# EAGLE schematic HotFireBoard (EAGLE 9.0.1)
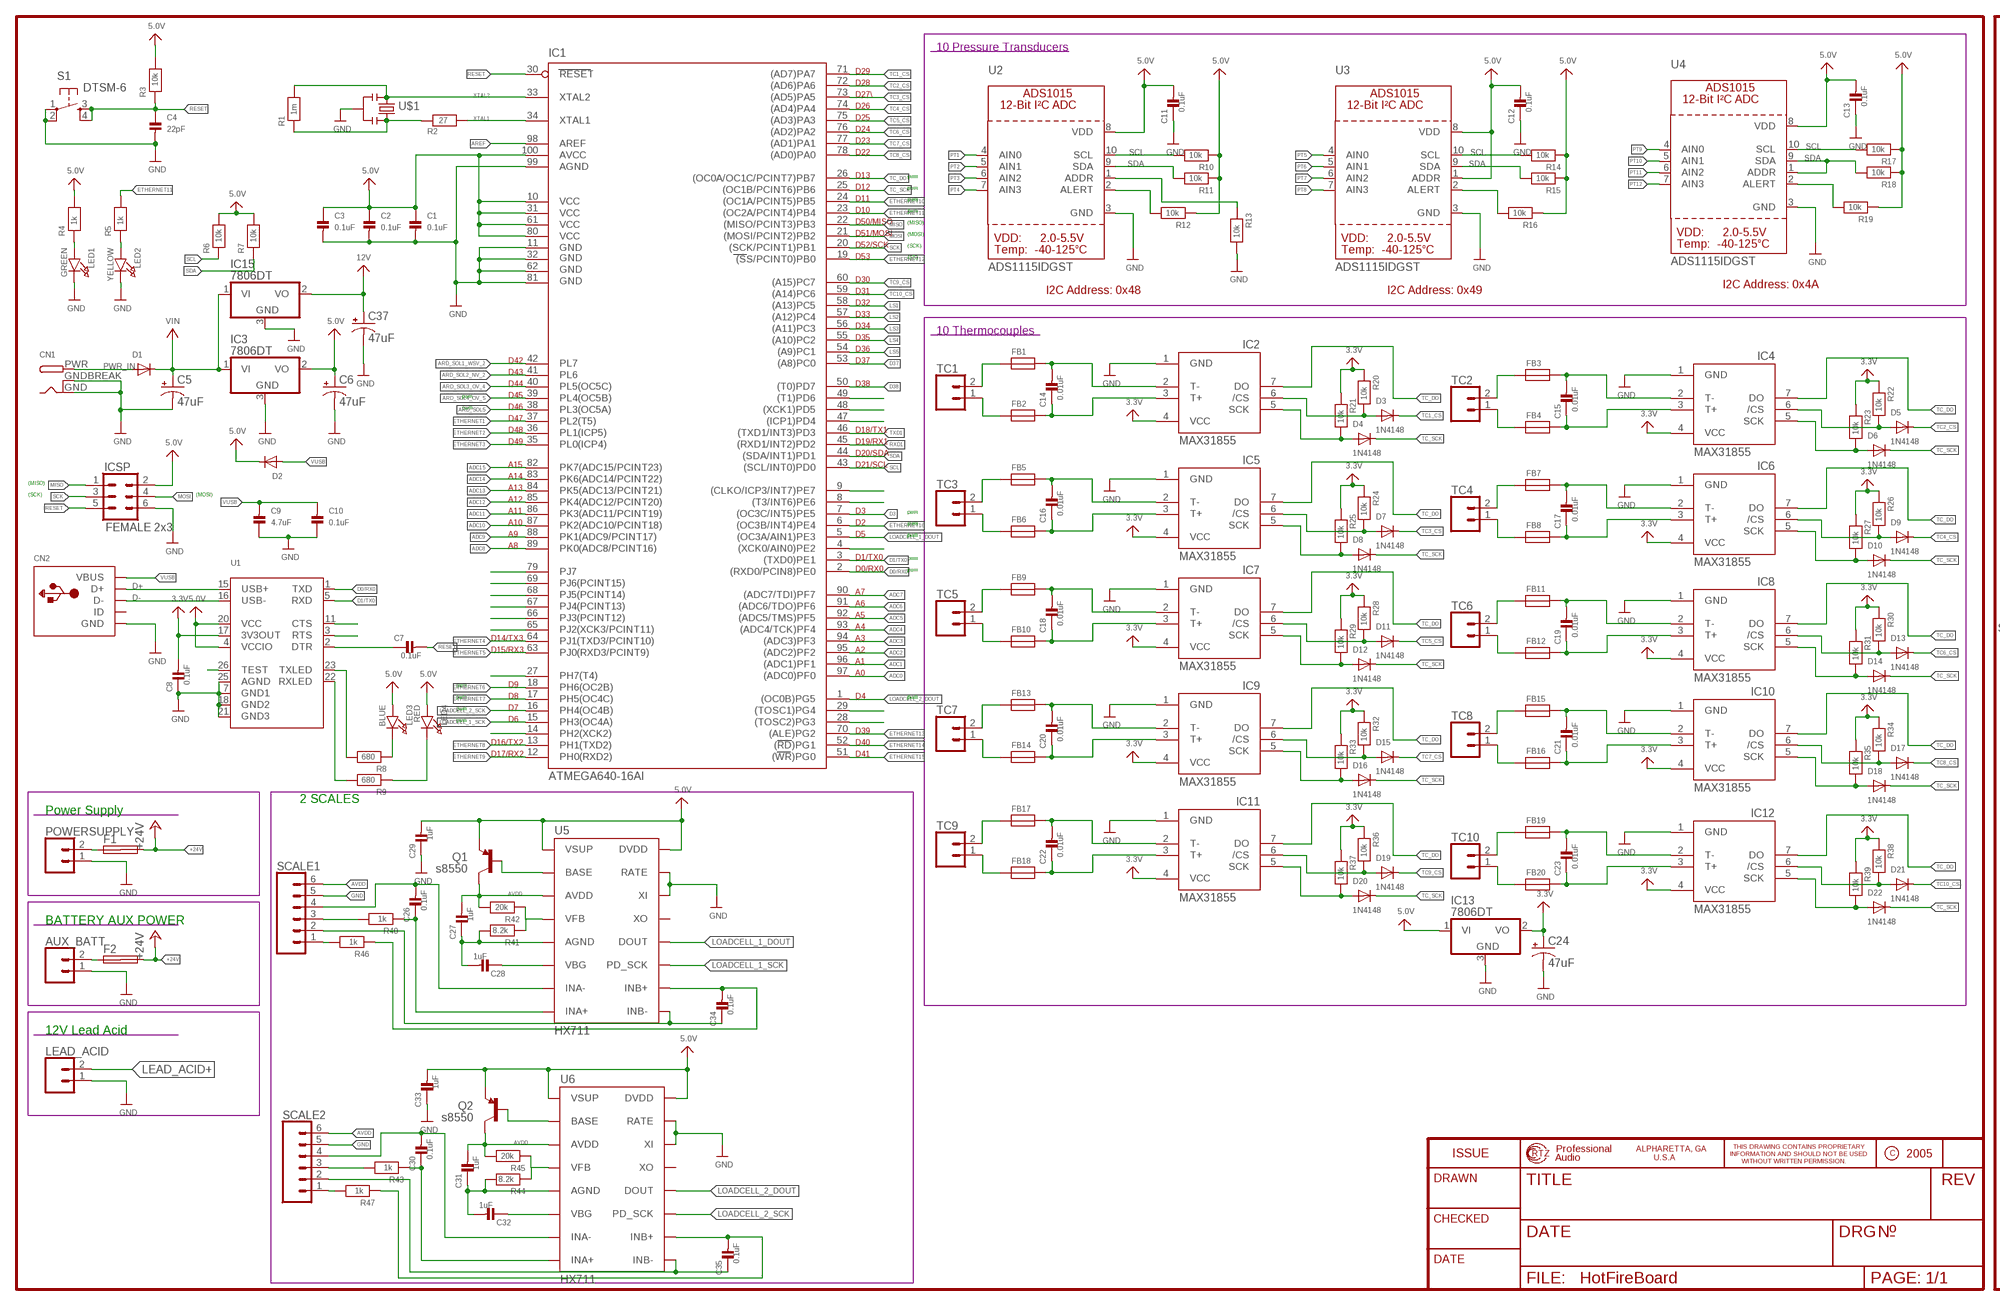
[diagram p0: schematic, sheet 1, part 1 of 2]
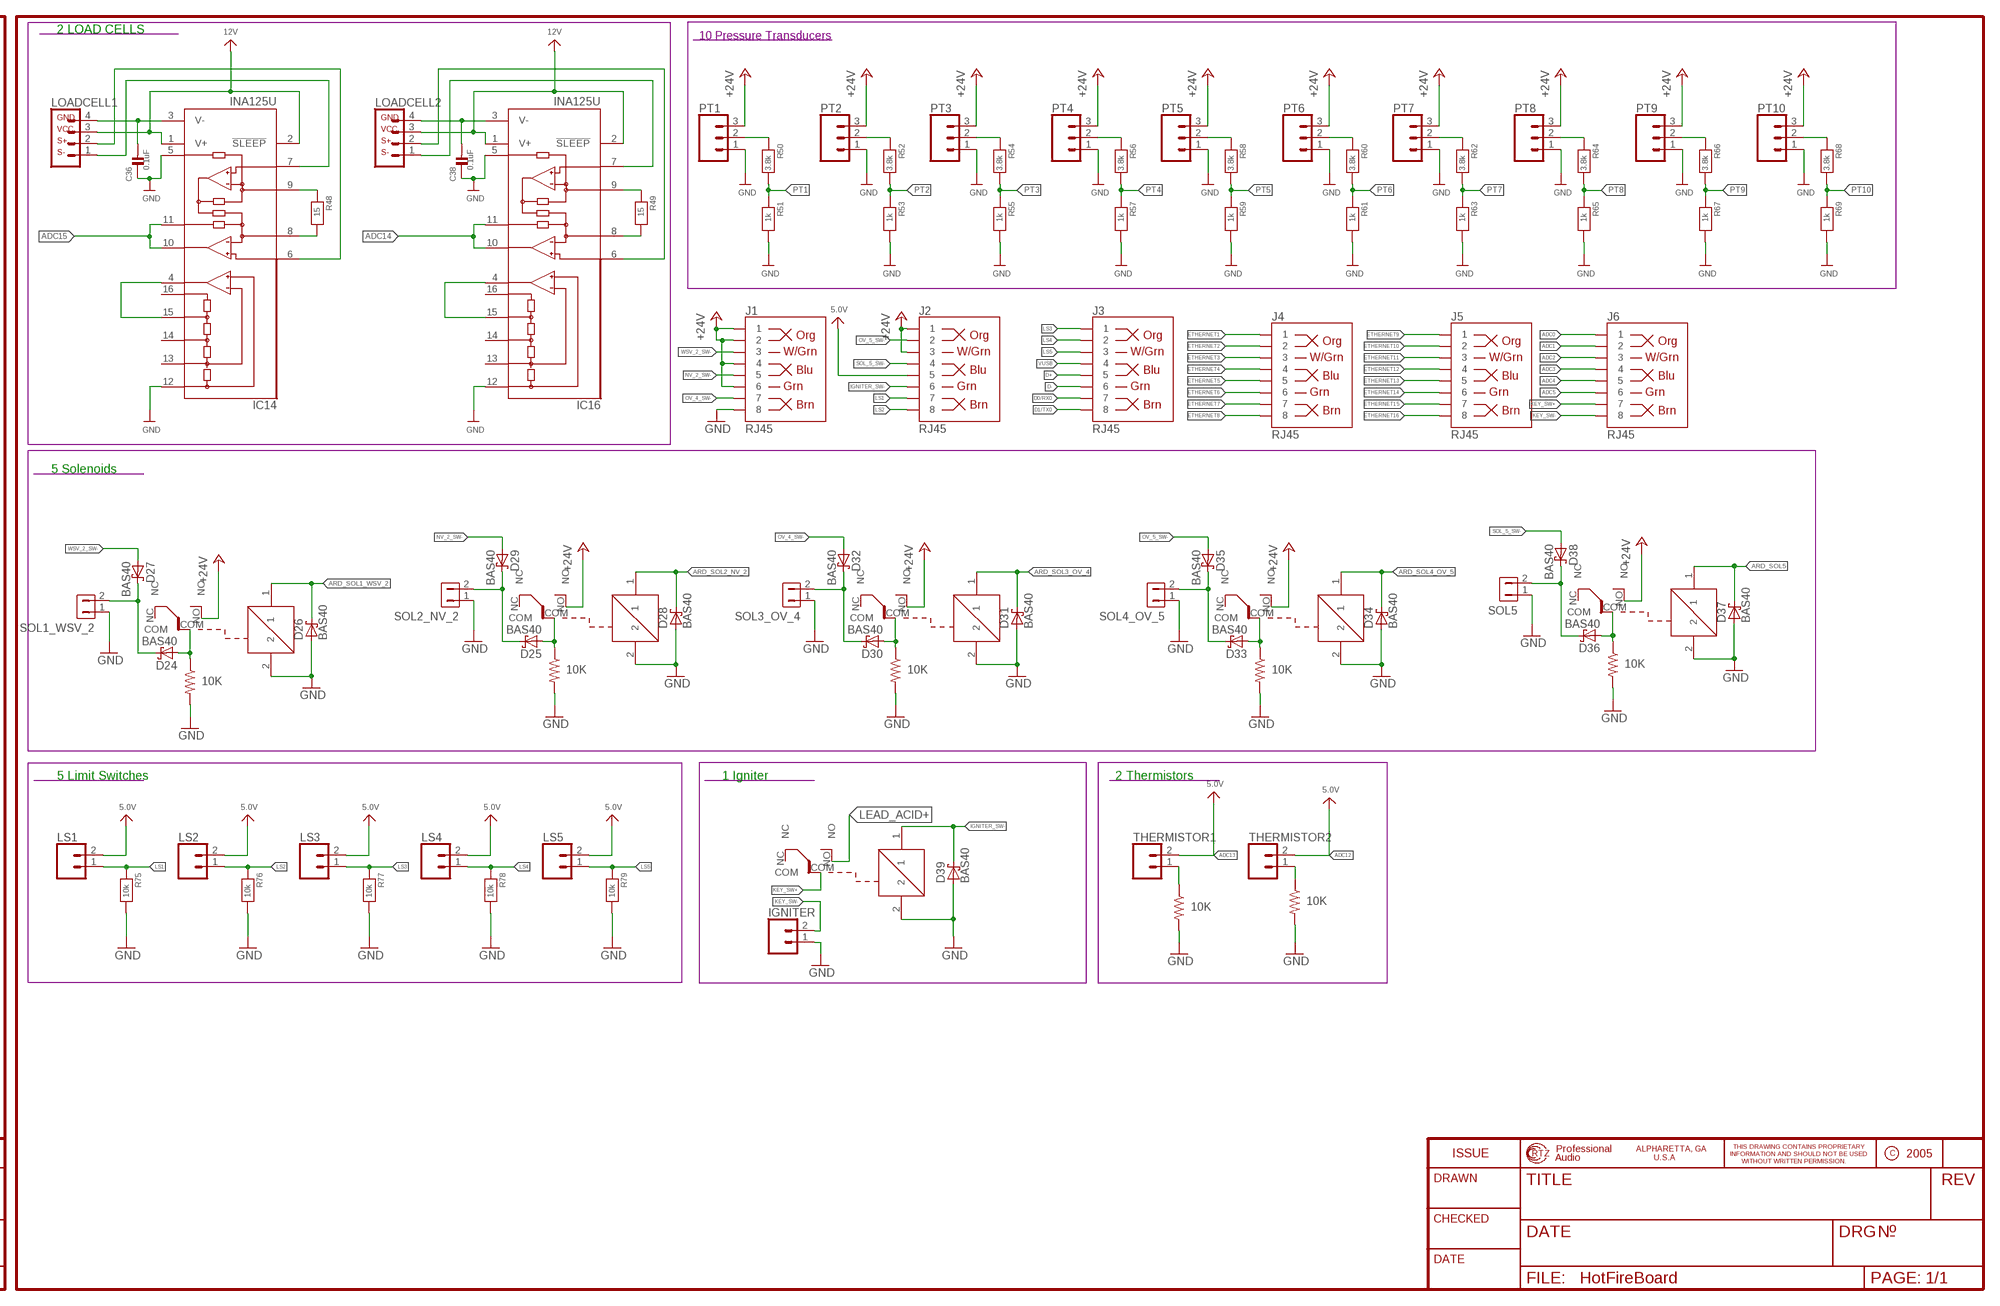
[diagram p1: schematic, sheet 1, part 2 of 2]

## Parts
AUX_BATT  CONN_02  [1X02]
C1  0.1uF  CAP_CERAMIC0805  [0805]
C2  0.1uF  CAP_CERAMIC0805  [0805]
C3  0.1uF  CAP_CERAMIC0805  [0805]
C4  22pF  CAP_CERAMIC0805  [0805]
C5  47uF  CPOL-USD  [PANASONIC_D]
C6  47uF  CPOL-USD  [PANASONIC_D]
C7  0.1uF  CAP_CERAMIC0805  [0805]
C8  0.1uF  CAP_CERAMIC0805  [0805]
C9  4.7uF  CAP_CERAMIC0805  [0805]
C10  0.1uF  CAP_CERAMIC0805  [0805]
C11  0.1uF  CAP_CERAMIC0805  [0805]
C12  0.1uF  CAP_CERAMIC0805  [0805]
C13  0.1uF  CAP_CERAMIC0805  [0805]
C14  0.01uF  CAP_CERAMIC0805  [0805]
C15  0.01uF  CAP_CERAMIC0805  [0805]
C16  0.01uF  CAP_CERAMIC0805  [0805]
C17  0.01uF  CAP_CERAMIC0805  [0805]
C18  0.01uF  CAP_CERAMIC0805  [0805]
C19  0.01uF  CAP_CERAMIC0805  [0805]
C20  0.01uF  CAP_CERAMIC0805  [0805]
C21  0.01uF  CAP_CERAMIC0805  [0805]
C22  0.01uF  CAP_CERAMIC0805  [0805]
C23  0.01uF  CAP_CERAMIC0805  [0805]
C24  47uF  CPOL-USD  [PANASONIC_D]
C26  0.1uF  CAP_CERAMIC0805  [0805]
C27  1uF  CAP_CERAMIC0805  [0805]
C28  1uF  CAP_CERAMIC0805  [0805]
C29  1uF  CAP_CERAMIC0805  [0805]
C30  0.1uF  CAP_CERAMIC0805  [0805]
C31  1uF  CAP_CERAMIC0805  [0805]
C32  1uF  CAP_CERAMIC0805  [0805]
C33  1uF  CAP_CERAMIC0805  [0805]
C34  0.1uF  CAP_CERAMIC0805  [0805]
C35  0.1uF  CAP_CERAMIC0805  [0805]
C36  0.1uF  CAP_CERAMIC0805  [0805]
C37  47uF  CPOL-USD  [PANASONIC_D]
C38  0.1uF  CAP_CERAMIC0805  [0805]
CN1  DCBARRELPTH  [DCJACK_2MM_PTH]
CN2  USBMINIB  [USB-MINIB]
D1  DIODESOD-123  [SOD-123]
D2  DIODESOD-123  [SOD-123]
D3  1N4148  DIODESOD-123  [SOD-123]
D4  1N4148  DIODESOD-123  [SOD-123]
D5  1N4148  DIODESOD-123  [SOD-123]
D6  1N4148  DIODESOD-123  [SOD-123]
D7  1N4148  DIODESOD-123  [SOD-123]
D8  1N4148  DIODESOD-123  [SOD-123]
D9  1N4148  DIODESOD-123  [SOD-123]
D10  1N4148  DIODESOD-123  [SOD-123]
D11  1N4148  DIODESOD-123  [SOD-123]
D12  1N4148  DIODESOD-123  [SOD-123]
D13  1N4148  DIODESOD-123  [SOD-123]
D14  1N4148  DIODESOD-123  [SOD-123]
D15  1N4148  DIODESOD-123  [SOD-123]
D16  1N4148  DIODESOD-123  [SOD-123]
D17  1N4148  DIODESOD-123  [SOD-123]
D18  1N4148  DIODESOD-123  [SOD-123]
D19  1N4148  DIODESOD-123  [SOD-123]
D20  1N4148  DIODESOD-123  [SOD-123]
D21  1N4148  DIODESOD-123  [SOD-123]
D22  1N4148  DIODESOD-123  [SOD-123]
D24  BAS40  [SOT23]
D25  BAS40  [SOT23]
D26  BAS40  [SOT23]
D27  BAS40  [SOT23]
D28  BAS40  [SOT23]
D29  BAS40  [SOT23]
D30  BAS40  [SOT23]
D31  BAS40  [SOT23]
D32  BAS40  [SOT23]
D33  BAS40  [SOT23]
D34  BAS40  [SOT23]
D35  BAS40  [SOT23]
D36  BAS40  [SOT23]
D37  BAS40  [SOT23]
D38  BAS40  [SOT23]
D39  BAS40  [SOT23]
F1  SHK20L  [SHK20L]
F2  SHK20L  [SHK20L]
FB1  FERRITE  [0603]
FB2  FERRITE  [0603]
FB3  FERRITE  [0603]
FB4  FERRITE  [0603]
FB5  FERRITE  [0603]
FB6  FERRITE  [0603]
FB7  FERRITE  [0603]
FB8  FERRITE  [0603]
FB9  FERRITE  [0603]
FB10  FERRITE  [0603]
FB11  FERRITE  [0603]
FB12  FERRITE  [0603]
FB13  FERRITE  [0603]
FB14  FERRITE  [0603]
FB15  FERRITE  [0603]
FB16  FERRITE  [0603]
FB17  FERRITE  [0603]
FB18  FERRITE  [0603]
FB19  FERRITE  [0603]
FB20  FERRITE  [0603]
IC1  ATMEGA640-16AI  [TQFP100]
IC2  MAX31855  MAX6675  [SO08]
IC3  7806DT  [TO252]
IC4  MAX31855  MAX6675  [SO08]
IC5  MAX31855  MAX6675  [SO08]
IC6  MAX31855  MAX6675  [SO08]
IC7  MAX31855  MAX6675  [SO08]
IC8  MAX31855  MAX6675  [SO08]
IC9  MAX31855  MAX6675  [SO08]
IC10  MAX31855  MAX6675  [SO08]
IC11  MAX31855  MAX6675  [SO08]
IC12  MAX31855  MAX6675  [SO08]
IC13  7806DT  [TO252]
IC14  INA125U  [SO16-1]
IC15  7806DT  [TO252]
IC16  INA125U  [SO16-1]
ICSP  FEMALE 2x3  CONN_03X2FEMALE  [2X3]
IGNITER  CONN_025MM  [SCREWTERMINAL-5MM-2]
J1  RJ45  RJ45-8  [RJ45-8]
J2  RJ45  RJ45-8  [RJ45-8]
J3  RJ45  RJ45-8  [RJ45-8]
J4  RJ45  RJ45-8  [RJ45-8]
J5  RJ45  RJ45-8  [RJ45-8]
J6  RJ45  RJ45-8  [RJ45-8]
LEAD_ACID  CONN_02  [1X02]
LED1  GREEN  LED0805  [CHIPLED_0805]
LED2  YELLOW  LED0805  [CHIPLED_0805]
LED3  BLUE  LED0805  [CHIPLED_0805]
LED4  RED  LED0805  [CHIPLED_0805]
LOADCELL1  CONN_04  [1X04]
LOADCELL2  CONN_04  [1X04]
LS1  CONN_02  [1X02]
LS2  CONN_02  [1X02]
LS3  CONN_02  [1X02]
LS4  CONN_02  [1X02]
LS5  CONN_02  [1X02]
POWERSUPPLY  CONN_02  [1X02]
PT1  CONN_03  [1X03]
PT2  CONN_03  [1X03]
PT3  CONN_03  [1X03]
PT4  CONN_03  [1X03]
PT5  CONN_03  [1X03]
PT6  CONN_03  [1X03]
PT7  CONN_03  [1X03]
PT8  CONN_03  [1X03]
PT9  CONN_03  [1X03]
PT10  CONN_03  [1X03]
Q1  s8550  TRANSISTOR_PNPTO92  [TO-92]
Q2  s8550  TRANSISTOR_PNPTO92  [TO-92]
R1  1m  RESISTOR0805  [0805]
R2  27  RESISTOR0805  [0805]
R3  10k  RESISTOR0805  [0805]
R4  1k  RESISTOR0805  [0805]
R5  1k  RESISTOR0805  [0805]
R6  10k  RESISTOR0805  [0805]
R7  10k  RESISTOR0805  [0805]
R8  680  RESISTOR0805  [0805]
R9  680  RESISTOR0805  [0805]
R10  10k  RESISTOR0805  [0805]
R11  10k  RESISTOR0805  [0805]
R12  10k  RESISTOR0805  [0805]
R13  10k  RESISTOR0805  [0805]
R14  10k  RESISTOR0805  [0805]
R15  10k  RESISTOR0805  [0805]
R16  10k  RESISTOR0805  [0805]
R17  10k  RESISTOR0805  [0805]
R18  10k  RESISTOR0805  [0805]
R19  10k  RESISTOR0805  [0805]
R20  10k  RESISTOR0805  [0805]
R21  10k  RESISTOR0805  [0805]
R22  10k  RESISTOR0805  [0805]
R23  10k  RESISTOR0805  [0805]
R24  10k  RESISTOR0805  [0805]
R25  10k  RESISTOR0805  [0805]
R26  10k  RESISTOR0805  [0805]
R27  10k  RESISTOR0805  [0805]
R28  10k  RESISTOR0805  [0805]
R29  10k  RESISTOR0805  [0805]
R30  10k  RESISTOR0805  [0805]
R31  10k  RESISTOR0805  [0805]
R32  10k  RESISTOR0805  [0805]
R33  10k  RESISTOR0805  [0805]
R34  10k  RESISTOR0805  [0805]
R35  10k  RESISTOR0805  [0805]
R36  10k  RESISTOR0805  [0805]
R37  10k  RESISTOR0805  [0805]
R38  10k  RESISTOR0805  [0805]
R39  10k  RESISTOR0805  [0805]
R40  1k  RESISTOR0805  [0805]
R41  8.2k  RESISTOR0805  [0805]
R42  20k  RESISTOR0805  [0805]
R43  1k  RESISTOR0805  [0805]
R44  8.2k  RESISTOR0805  [0805]
R45  20k  RESISTOR0805  [0805]
R46  1k  RESISTOR0805  [0805]
R47  1k  RESISTOR0805  [0805]
R48  15  RESISTOR0805  [0805]
R49  15  RESISTOR0805  [0805]
R50  3.8k  RESISTOR0805  [0805]
R51  1k  RESISTOR0805  [0805]
R52  3.8k  RESISTOR0805  [0805]
R53  1k  RESISTOR0805  [0805]
R54  3.8k  RESISTOR0805  [0805]
R55  1k  RESISTOR0805  [0805]
R56  3.8k  RESISTOR0805  [0805]
R57  1k  RESISTOR0805  [0805]
R58  3.8k  RESISTOR0805  [0805]
R59  1k  RESISTOR0805  [0805]
R60  3.8k  RESISTOR0805  [0805]
R61  1k  RESISTOR0805  [0805]
R62  3.8k  RESISTOR0805  [0805]
R63  1k  RESISTOR0805  [0805]
R64  3.8k  RESISTOR0805  [0805]
R65  1k  RESISTOR0805  [0805]
R66  3.8k  RESISTOR0805  [0805]
R67  1k  RESISTOR0805  [0805]
R68  3.8k  RESISTOR0805  [0805]
R69  1k  RESISTOR0805  [0805]
R70  10K  R-US_M0805  [M0805]
R71  10K  R-US_M0805  [M0805]
R72  10K  R-US_M0805  [M0805]
R73  10K  R-US_M0805  [M0805]
R74  10K  R-US_M0805  [M0805]
R75  10k  RESISTOR0805  [0805]
R76  10k  RESISTOR0805  [0805]
R77  10k  RESISTOR0805  [0805]
R78  10k  RESISTOR0805  [0805]
R79  10k  RESISTOR0805  [0805]
R80  10K  R-US_M0805  [M0805]
R81  10K  R-US_M0805  [M0805]
S1  DTSM-6  [DTSM-6]
SCALE1  CONN_06SILK_FEMALE_PTH  [1X06]
SCALE2  CONN_06SILK_FEMALE_PTH  [1X06]
SOL1_WSV_2  HDR-1X2-MTA-100  [MTA-100-2V]
SOL2_NV_2  HDR-1X2-MTA-100  [MTA-100-2V]
SOL3_OV_4  HDR-1X2-MTA-100  [MTA-100-2V]
SOL4_OV_5  HDR-1X2-MTA-100  [MTA-100-2V]
SOL5  HDR-1X2-MTA-100  [MTA-100-2V]
TC1  CONN_02  [1X02]
TC2  CONN_02  [1X02]
TC3  CONN_02  [1X02]
TC4  CONN_02  [1X02]
TC5  CONN_02  [1X02]
TC6  CONN_02  [1X02]
TC7  CONN_02  [1X02]
TC8  CONN_02  [1X02]
TC9  CONN_02  [1X02]
TC10  CONN_02  [1X02]
THERMISTOR1  CONN_02  [1X02]
THERMISTOR2  CONN_02  [1X02]
U1  FT232RLSSOP28  [SSOP28DB]
U2  ADS1115IDGST  ADC_ADS1015  [MSOP10]
U3  ADS1115IDGST  ADC_ADS1015  [MSOP10]
U4  ADS1115IDGST  ADC_ADS1015  [MSOP10]
U5  HX711  [SO16]
U6  HX711  [SO16]
U$1  RESONATORSMD  [RESONATOR-SMD]
U$128  RW-SH  [RW-SH]
U$129  RW-SH  [RW-SH]
U$130  RW-SH  [RW-SH]
U$131  RW-SH  [RW-SH]
U$132  RW-SH  [RW-SH]
U$138  RW-SH  [RW-SH]

## Nets
3.3V [16mil]: C8.2 C24.+ IC2.4(VCC) IC4.4(VCC) IC5.4(VCC) IC6.4(VCC) IC7.4(VCC) IC8.4(VCC) IC9.4(VCC) IC10.4(VCC) IC11.4(VCC) IC12.4(VCC) IC13.2(VO) R20.1 R21.1 R22.1 R23.1 R24.1 R25.1 R26.1 R27.1 R28.1 R29.1 R30.1 R31.1 R32.1 R33.1 R34.1 R35.1 R36.1 R37.1 R38.1 R39.1 U1.17(3V3OUT)
5.0V [16mil]: C1.1 C2.1 C3.1 C6.+ C11.2 C12.2 C13.2 C29.2 C33.2 D2.C IC1.10(VCC) IC1.31(VCC1) IC1.61(VCC2) IC1.80(VCC3) IC1.100(AVCC) IC3.2(VO) IC13.1(VI) ICSP.2 J2.5 LED3.A LED4.A LS1.2 LS2.2 LS3.2 LS4.2 LS5.2 Q1.1(E) Q2.1(E) R3.2 R4.2 R6.2 R7.2 R10.1 R11.1 R12.1 R14.1 R15.1 R16.1 R17.1 R18.1 R19.1 U1.4(VCCIO) U1.20(VCC) U2.8(VDD) U3.1(ADDR) U3.8(VDD) U4.8(VDD) U5.1(VSUP) U5.16(DVDD) U6.1(VSUP) U6.16(DVDD)
12V [24mil]: C37.+ IC14.1(V+) IC14.2(!SLEEP) IC15.2(VO) IC16.1(V+) IC16.2(!SLEEP) LOADCELL1.3 LOADCELL2.3
+24V [24mil]: F1.2A F2.2A J1.1 J1.2 J1.4 J1.6 J2.1 J2.3 PT1.3 PT2.3 PT3.3 PT4.3 PT5.3 PT6.3 PT7.3 PT8.3 PT9.3 PT10.3 U$128.NO U$129.NO U$130.NO U$131.NO U$132.NO
ADC0: IC1.97((ADC0)PF0) J6.1
ADC1: IC1.96((ADC1)PF1) J6.2
ADC2: IC1.95((ADC2)PF2) J6.3
ADC3: IC1.94((ADC3)PF3) J6.4
ADC4: IC1.93((ADC4/TCK)PF4) J6.5
ADC5: IC1.92((ADC5/TMS)PF5) J6.6
ADC6: IC1.91((ADC6/TDO)PF6)
ADC7: IC1.90((ADC7/TDI)PF7)
ADC8: IC1.89(PK0(ADC8/PCINT16))
ADC9: IC1.88(PK1(ADC9/PCINT17))
ADC10: IC1.87(PK2(ADC10/PCINT18))
ADC11: IC1.86(PK3(ADC11/PCINT19))
ADC12: IC1.85(PK4(ADC12/PCINT20)) THERMISTOR2.2 ; supply symbol labelled 5.0V
ADC13: IC1.84(PK5(ADC13/PCINT21)) THERMISTOR1.2 ; supply symbol labelled 5.0V
ADC14: IC1.83(PK6(ADC14/PCINT22)) IC16.10(OUT) IC16.11(SENSE)
ADC15: IC1.82(PK7(ADC15/PCINT23)) IC14.10(OUT) IC14.11(SENSE)
ARD_SOL1_WSV_2: D26.3(C) IC1.42(PL7) U$128.1
ARD_SOL2_NV_2: D28.3(C) IC1.41(PL6) U$129.1
ARD_SOL3_OV_4: D31.3(C) IC1.40(PL5(OC5C)) U$130.1
ARD_SOL4_OV_5: D34.3(C) IC1.39(PL4(OC5B)) U$131.1
ARD_SOL5: D37.3(C) IC1.38(PL3(OC5A)) U$132.1
AREF: IC1.98(AREF)
AVDD: C27.2 C31.2 Q1.3(C) Q2.3(C) R42.2 R45.2 SCALE1.6 SCALE2.6 U5.3(AVDD) U6.3(AVDD)
D0/RX0: IC1.2((RXD0/PCIN8)PE0) J3.7 U1.1(TXD)
D1/TX0: IC1.3((TXD0)PE1) J3.8 U1.5(RXD)
D3: IC1.7((OC3C/INT5)PE5)
D37: IC1.53((A8)PC0)
D38: IC1.50((T0)PD7)
D+: CN2.D+ J3.5 U1.15(USB+)
D-: CN2.D- J3.6 U1.16(USB-)
ETHERNET1: IC1.37(PL2(T5)) J4.1
ETHERNET2: IC1.36(PL1(ICP5)) J4.2
ETHERNET3: IC1.35(PL0(ICP4)) J4.3
ETHERNET4: IC1.64(PJ1(TXD3/PCINT10)) J4.4
ETHERNET5: IC1.63(PJ0(RXD3/PCINT9)) J4.5
ETHERNET6: IC1.18(PH6(OC2B)) J4.6
ETHERNET7: IC1.17(PH5(OC4C)) J4.7
ETHERNET8: IC1.13(PH1(TXD2)) J4.8
ETHERNET9: IC1.12(PH0(RXD2)) J5.1
ETHERNET10: IC1.24((OC1A/PCINT5)PB5) J5.2
ETHERNET11: IC1.23((OC2A/PCINT4)PB4) J5.3 R5.2
ETHERNET12: IC1.19((SS/PCINT0)PB0) J5.4
ETHERNET13: IC1.70((ALE)PG2) J5.5
ETHERNET14: IC1.52((RD)PG1) J5.6
ETHERNET15: IC1.51((WR)PG0) J5.7
ETHERNET16: IC1.6((OC3B/INT4)PE4) J5.8
GND [32mil]: AUX_BATT.1 C1.2 C2.2 C3.2 C4.2 C5.- C6.- C8.1 C9.1 C10.1 C11.1 C12.1 C13.1 C24.- C29.1 C33.1 C36.1 C37.- C38.1 CN1.GND CN1.GNDBREAK CN2.GND D26.1(A) D28.1(A) D31.1(A) D34.1(A) D37.1(A) D39.1(A) IC1.11(GND) IC1.32(GND1) IC1.62(GND2) IC1.81(GND3) IC1.99(AGND) IC2.1(GND) IC3.3(GND) IC4.1(GND) IC5.1(GND) IC6.1(GND) IC7.1(GND) IC8.1(GND) IC9.1(GND) IC10.1(GND) IC11.1(GND) IC12.1(GND) IC13.3(GND) IC14.5(REF) IC14.12(REFCOM) IC15.3(GND) IC16.5(REF) IC16.12(REFCOM) ICSP.6 IGNITER.1 J1.8 LEAD_ACID.1 LED1.C LED2.C POWERSUPPLY.1 PT1.1 PT2.1 PT3.1 PT4.1 PT5.1 PT6.1 PT7.1 PT8.1 PT9.1 PT10.1 R13.2 R51.2 R53.2 R55.2 R57.2 R59.2 R61.2 R63.2 R65.2 R67.2 R69.2 R70.2 R71.2 R72.2 R73.2 R74.2 R75.2 R76.2 R77.2 R78.2 R79.2 R80.2 R81.2 S1.1 S1.2 SCALE1.5 SCALE2.5 SOL1_WSV_2.1 SOL2_NV_2.1 SOL3_OV_4.1 SOL4_OV_5.1 SOL5.1 U1.7(GND1) U1.18(GND2) U1.21(GND3) U1.25(AGND) U2.3(GND) U3.3(GND) U4.3(GND) U5.14(XI) U5.15(RATE) U6.14(XI) U6.15(RATE) U$1.2 U$128.2 U$129.2 U$130.2 U$131.2 U$132.2 U$138.2
IGNITER_SW- [32mil]: D39.3(C) J2.6 U$138.1
KEY_SW+ [32mil]: J6.7 U$138.COM
KEY_SW-: IGNITER.2 J6.8
LEAD_ACID+ [32mil]: LEAD_ACID.2 U$138.NO
LOADCELL_1_DOUT: IC1.5((OC3A/AIN1)PE3) U5.12(DOUT)
LOADCELL_1_SCK: IC1.15(PH3(OC4A)) U5.11(PD_SCK)
LOADCELL_2_DOUT: IC1.1((OC0B)PG5) U6.12(DOUT)
LOADCELL_2_SCK: IC1.16(PH4(OC4B)) U6.11(PD_SCK)
LS1: IC1.58((A13)PC5) J2.7 LS1.1 R75.1
LS2: IC1.57((A12)PC4) J2.8 LS2.1 R76.1
LS3: IC1.56((A11)PC3) J3.1 LS3.1 R77.1
LS4: IC1.55((A10)PC2) J3.2 LS4.1 R78.1
LS5: IC1.54((A9)PC1) J3.3 LS5.1 R79.1
MISO: IC1.22((MISO/PCINT3)PB3) ICSP.1
MOSI: IC1.21((MOSI/PCINT2)PB2) ICSP.4
N$1: IC1.65(PJ2(XCK3/PCINT11))
N$2: IC1.66(PJ3(PCINT12))
N$3: R1.1 R2.2 U$1.3
N$4: IC1.67(PJ4(PCINT13))
N$5: IC1.68(PJ5(PCINT14))
N$6: IC1.69(PJ6(PCINT15))
N$7: IC1.79(PJ7)
N$8: IC1.27(PH7(T4))
N$9: IC1.9((CLKO/ICP3/INT7)PE7)
N$10: IC1.49((T1)PD6)
N$11: IC1.48((XCK1)PD5)
N$12: IC1.47((ICP1)PD4)
N$13: IC1.14(PH2(XCK2))
N$14: IC1.8((T3/INT6)PE6)
N$15 [24mil]: F1.1A POWERSUPPLY.2
N$16 [24mil]: AUX_BATT.2 F2.1A
N$18: IC1.4((XCK0/AIN0)PE2)
N$19: LED1.A R4.1
N$20: LED2.A R5.1
N$21: LED3.C R8.1
N$22: R9.2 U1.22(RXLED)
N$23: R8.2 U1.23(TXLED)
N$24: LED4.C R9.1
N$25: IC1.29((TOSC1)PG4)
N$26: IC1.28((TOSC2)PG3)
N$27: C14.1 FB2.2 IC2.3(T+)
N$28: U1.26(TEST)
N$29: U1.11(CTS)
N$30: U1.3(RTS)
N$31: C7.1 U1.2(DTR)
N$32: C14.2 FB1.2 IC2.2(T-)
N$34: D3.A IC2.6(/CS) R20.2
N$38: R12.2 U2.2(ALERT)
N$40: R16.2 U3.2(ALERT)
N$41: R13.1 U2.1(ADDR)
N$43: FB1.1 TC1.2
N$44: R19.2 U4.2(ALERT)
N$46: FB2.1 TC1.1
N$47: D4.A IC2.5(SCK) R21.2
N$48: C15.2 FB3.2 IC4.2(T-)
N$51: C15.1 FB4.2 IC4.3(T+)
N$52: FB3.1 TC2.2
N$53: FB4.1 TC2.1
N$54: D5.A IC4.6(/CS) R22.2
N$55: D6.A IC4.5(SCK) R23.2
N$56: C16.2 FB5.2 IC5.2(T-)
N$57: C16.1 FB6.2 IC5.3(T+)
N$58: FB5.1 TC3.2
N$59: FB6.1 TC3.1
N$60: D7.A IC5.6(/CS) R24.2
N$61: D8.A IC5.5(SCK) R25.2
N$62: C17.2 FB7.2 IC6.2(T-)
N$63: C17.1 FB8.2 IC6.3(T+)
N$64: FB7.1 TC4.2
N$65: FB8.1 TC4.1
N$66: D9.A IC6.6(/CS) R26.2
N$67: D10.A IC6.5(SCK) R27.2
N$68: C18.2 FB9.2 IC7.2(T-)
N$69: C18.1 FB10.2 IC7.3(T+)
N$70: FB9.1 TC5.2
N$71: FB10.1 TC5.1
N$72: D11.A IC7.6(/CS) R28.2
N$73: D12.A IC7.5(SCK) R29.2
N$74: C19.2 FB11.2 IC8.2(T-)
N$75: C19.1 FB12.2 IC8.3(T+)
N$76: FB11.1 TC6.2
N$77: FB12.1 TC6.1
N$78: D13.A IC8.6(/CS) R30.2
N$79: D14.A IC8.5(SCK) R31.2
N$80: C20.2 FB13.2 IC9.2(T-)
N$81: C20.1 FB14.2 IC9.3(T+)
N$82: FB13.1 TC7.2
N$83: FB14.1 TC7.1
N$84: D15.A IC9.6(/CS) R32.2
N$85: D16.A IC9.5(SCK) R33.2
N$86: C21.2 FB15.2 IC10.2(T-)
N$87: C21.1 FB16.2 IC10.3(T+)
N$88: FB15.1 TC8.2
N$89: FB16.1 TC8.1
N$90: D17.A IC10.6(/CS) R34.2
N$91: D18.A IC10.5(SCK) R35.2
N$92: C22.2 FB17.2 IC11.2(T-)
N$93: C22.1 FB18.2 IC11.3(T+)
N$94: FB17.1 TC9.2
N$95: FB18.1 TC9.1
N$96: D19.A IC11.6(/CS) R36.2
N$97: D20.A IC11.5(SCK) R37.2
N$98: C23.2 FB19.2 IC12.2(T-)
N$99: C23.1 FB20.2 IC12.3(T+)
N$100: FB19.1 TC10.2
N$101: FB20.1 TC10.1
N$102: D21.A IC12.6(/CS) R38.2
N$103: D22.A IC12.5(SCK) R39.2
N$104: R40.2 SCALE1.3
N$105: C26.1 R40.1 U5.8(INA+)
N$106: C26.2 SCALE1.4 U5.7(INA-)
N$107: R43.2 SCALE2.3
N$108: C27.1 C28.2 R41.2 U5.5(AGND)
N$109: C28.1 U5.6(VBG)
N$110: R41.1 R42.1 U5.4(VFB)
N$111: Q1.2(B) U5.2(BASE)
N$112: C30.1 R43.1 U6.8(INA+)
N$113: C30.2 SCALE2.4 U6.7(INA-)
N$114: C31.1 C32.2 R44.2 U6.5(AGND)
N$115: C32.1 U6.6(VBG)
N$116: R44.1 R45.1 U6.4(VFB)
N$117: Q2.2(B) U6.2(BASE)
N$118: C34.1 SCALE1.2 U5.9(INB-)
N$119: C34.2 R46.1 U5.10(INB+)
N$120: R46.2 SCALE1.1
N$121: C35.1 SCALE2.2 U6.9(INB-)
N$122: C35.2 R47.1 U6.10(INB+)
N$123: R47.2 SCALE2.1
N$124: C36.2 IC14.3(V-) LOADCELL1.4
N$125: C38.2 IC16.3(V-) LOADCELL2.4
N$126: IC14.9(RG) R48.1
N$127: IC14.8(RG) R48.2
N$128: IC14.6(+IN) LOADCELL1.2
N$129: IC16.9(RG) R49.1
N$130: IC16.8(RG) R49.2
N$131: IC16.6(+IN) LOADCELL2.2
N$132: IC14.4(REFOUT) IC14.15(REF5)
N$133: IC14.7(-IN) LOADCELL1.1
N$134: IC16.4(REFOUT) IC16.15(REF5)
N$135: IC16.7(-IN) LOADCELL2.1
N$136: PT1.2 R50.1
N$137: PT2.2 R52.1
N$138: PT3.2 R54.1
N$139: PT4.2 R56.1
N$140: PT5.2 R58.1
N$141: PT6.2 R60.1
N$142: PT7.2 R62.1
N$143: PT8.2 R64.1
N$144: PT9.2 R66.1
N$145: PT10.2 R68.1
N$146 [24mil]: D24.3(C) D27.3(C) SOL1_WSV_2.2
N$147 [24mil]: D24.1(A) R70.1 U$128.COM
N$148 [24mil]: D25.3(C) D29.3(C) SOL2_NV_2.2
N$149 [24mil]: D25.1(A) R71.1 U$129.COM
N$150 [24mil]: D30.3(C) D32.3(C) SOL3_OV_4.2
N$151 [24mil]: D30.1(A) R72.1 U$130.COM
N$152 [24mil]: D33.3(C) D35.3(C) SOL4_OV_5.2
N$153 [24mil]: D33.1(A) R73.1 U$131.COM
N$154 [24mil]: D36.3(C) D38.3(C) SOL5.2
N$155 [24mil]: D36.1(A) R74.1 U$132.COM
N$156: R80.1 THERMISTOR1.1
N$159: R81.1 THERMISTOR2.1
NV_2_SW- [24mil]: D29.1(A) J1.5
OV_4_SW- [24mil]: D32.1(A) J1.7
OV_5_SW- [24mil]: D35.1(A) J2.2
PT1: R50.2 R51.1 U2.4(AIN0)
PT2: R52.2 R53.1 U2.5(AIN1)
PT3: R54.2 R55.1 U2.6(AIN2)
PT4: R56.2 R57.1 U2.7(AIN3)
PT5: R58.2 R59.1 U3.4(AIN0)
PT6: R60.2 R61.1 U3.5(AIN1)
PT7: R62.2 R63.1 U3.6(AIN2)
PT8: R64.2 R65.1 U3.7(AIN3)
PT9: R66.2 R67.1 U4.4(AIN0)
PT10: R68.2 R69.1 U4.5(AIN1)
PT11: U4.6(AIN2)
PT12: U4.7(AIN3)
PWR_IN [32mil]: CN1.PWR D1.A
RESET: C4.1 C7.2 IC1.30(RESET) ICSP.5 R3.1 S1.3 S1.4
RXD1: IC1.45((RXD1/INT2)PD2)
SCK: IC1.20((SCK/PCINT1)PB1) ICSP.3
SCL: IC1.43((SCL/INT0)PD0) R6.1 R10.2 R14.2 R17.2 U2.10(SCL) U3.10(SCL) U4.10(SCL)
SDA: IC1.44((SDA/INT1)PD1) R7.1 R11.2 R15.2 R18.2 U2.9(SDA) U3.9(SDA) U4.1(ADDR) U4.9(SDA)
SOL_5_SW- [24mil]: D38.1(A) J2.4
TC1_CS: D3.C IC1.71((AD7)PA7)
TC2_CS: D5.C IC1.72((AD6)PA6)
TC3_CS: D7.C IC1.73((AD5)PA5)
TC4_CS: D9.C IC1.74((AD4)PA4)
TC5_CS: D11.C IC1.75((AD3)PA3)
TC6_CS: D13.C IC1.76((AD2)PA2)
TC7_CS: D15.C IC1.77((AD1)PA1)
TC8_CS: D17.C IC1.78((AD0)PA0)
TC9_CS: D19.C IC1.60((A15)PC7)
TC10_CS: D21.C IC1.59((A14)PC6)
TC_DO: IC1.26((OC0A/OC1C/PCINT7)PB7) IC2.7(DO) IC4.7(DO) IC5.7(DO) IC6.7(DO) IC7.7(DO) IC8.7(DO) IC9.7(DO) IC10.7(DO) IC11.7(DO) IC12.7(DO)
TC_SCK: D4.C D6.C D8.C D10.C D12.C D14.C D16.C D18.C D20.C D22.C IC1.25((OC1B/PCINT6)PB6)
TXD1: IC1.46((TXD1/INT3)PD3)
VIN [24mil]: C5.+ D1.C IC3.1(VI) IC15.1(VI)
VUSB [16mil]: C9.2 C10.2 CN2.VBUS D2.A J3.4
WSV_2_SW- [24mil]: D27.1(A) J1.3
XTAL1: IC1.34(XTAL1) R2.1
XTAL2: IC1.33(XTAL2) R1.2 U$1.1
Unconnected: CN2.ID F1.1B F1.2B F2.1B F2.2B IC14.13(REFBG) IC14.14(REF2.5) IC14.16(REF10) IC16.13(REFBG) IC16.14(REF2.5) IC16.16(REF10) U5.13(XO) U6.13(XO) U$128.NC U$129.NC U$130.NC U$131.NC U$132.NC U$138.NC

## Notes on the sheet
- 2 LOAD CELLS
- 10 Pressure Transducers
- 10 Pressure Transducers
- D29
- D28
- D27\
- D26
- D25 | GND | GND
- D24 | VCC | VCC
- D23 | S+ | S+
- D22 | S- | S-
- D13 | pwm
- D12 | pwm
- D11 | pwm
- D10 | pwm
- D50/MISO | (MISO)
- D51/MOSI | (MOSI)
- D52/SCK | (SCK)
- D53 | (SS)
- D30
- I2C Address: 0x4A
- D31 | I2C Address: 0x48 | I2C Address: 0x49
- D32
- D33
- D34
- 10 Thermocouples
- D35
- D36
- D42 | D37
- D43
- D44 | D38
- pwm | D45
- pwm | D46
- D47
- D48 | D18/TX1
- D49 | D19/RX1
- D20/SDA
- A15 | D21/SCL
- 5 Solenoids
- A14
- (MISO)
- A13
- (SCK) | (MOSI)
- A12
- A11 | D3 | pwm
- A10 | D2 | pwm
- A9 | D5 | pwm
- A8
- D1/TX0 | pwm
- D0/RX0 | pwm
- A7
- A6
- A5
- A4
- D14/TX3 | A3
- D15/RX3 | A2
- A1
- A0
- pwm | D9
- pwm | D8 | D4 | pwm
- pwm | D7
- pwm | D6
- D39
- D16/TX2 | D40
- D17/RX2 | D41
- 5 Limit Switches | 1 Igniter | 2 Thermistors
- 2 SCALES
- Power Supply
- BATTERY AUX POWER
- 12V Lead Acid

## Library data of the parts
AUX_BATT LEAD_ACID LS1-LS5 POWERSUPPLY TC1-TC10 THERMISTOR1 THERMISTOR2 = SparkFun-Connectors:CONN_02: Multi connection point. Often used as Generic Header-pin footprint for 0.1 inch spaced/style header connections On any of the 0.1 inch spaced packages, you can populate with these: Break Away Headers - Straight <https://www.sparkfun.com/products/116> (PRT-00116) Break Away Male Headers - Right Angle <https://www.sparkfun.com/products/553> (PRT-00553) Female Headers <https://www.sparkfun.com/products/115> (PRT-00115) Break Away Headers - Machine Pin <https://www.sparkfun.com/products/117> (PRT-00117) Break Away Female Headers - Swiss Machine Pin <https://www.sparkfun.com/products/743> (PRT-00743) For SCREWTERMINALS and SPRING TERMINALS visit here: Screw Terimnals on SparkFun.com <https://www.sparkfun.com/search/results?term=Screw+Terminals> (5mm/3.5mm/2.54mm spacing) This device is also useful as a general connection point to wire up your design to another part of your project. Our various solder wires solder well into these plated through hole pads. Hook-Up Wire - Assortment (Stranded, 22 AWG) <https://www.sparkfun.com/products/11375> (PRT-11375) Hook-Up Wire - Assortment (Solid Core, 22 AWG) <https://www.sparkfun.com/products/11367> (PRT-11367) View the entire wire category on our website here <https://www.sparkfun.com/categories/141> Special notes: Molex polarized connector foot print use with: PRT-08233 with associated crimp pins and housings. 2.54_SCREWTERM for use with PRT-10571. 3.5mm Screw Terminal footprints for PRT-08084 5mm Screw Terminal footprints for use with PRT-08432
C1-C4 C7-C23 C26-C36 C38 = microbuilder:CAP_CERAMIC: Ceramic Capacitors 0402 - 0402 Surface Mount Capacitors 16pF 50V 5% [Digikey: 445-4899-2-ND] 18pF 50V 5% [Digikey: 490-1281-2-ND] 22pF 50V 5% [Digikey: 490-1283-2-ND] 68pF 50V 5% [Digikey: 490-1289-2-ND] 0.1uF 10V 10% [Digikey: 490-1318-2-ND] 1.0uF 6.3V 10% [Digikey: 490-1320-2-ND] 0603 - 0603 Surface Mount Capacitors 16 pF 50V 5% [Digikey: 445-5051-2-ND] 22 pF 50V [Digikey: PCC220ACVTR-ND] 33 pF 50V 5% [Digikey: 490-1415-1-ND] 56pF 50V 5% [Digikey: 490-1421-1-ND] 220pF 50V 5% [Digikey: 445-1285-1-ND] 680 pF 50V 2200 pF 50V 5% C0G [Digikey: 445-1297-1-ND] 5600 pF 100V 5% X7R [Digikey: 478-3711-1-ND] 0.1 µF 25V 10% [Digikey: PCC2277TR-ND] 0.22 µF 16V 10% X7R [Digikey: 445-1318-1-ND] 1.0 µF 25V 10% [Digikey: 445-5146-2-ND] 0603 - RF Specific 3pF 250V +/-0.1pF RF [Digikey: 712-1347-1-ND] 18 pF 250V 5% [Digikey: 478-3505-1-ND or 712-1322-1-ND] 56 pF 250V 5% C0G RF [Digikey: 490-4867-1-ND] 68 pF 250V RF [Digikey: 490-4868-1-ND] 0805 - 0805 Surface Mount Capacitors 220 pF 250V 2% RF Ceramic Capacitor [Digikey: 712-1398-1-ND] 1000 pF 50V 2% NP0 Ceramic Capacitor [Digikey: 478-3760-1-ND] 0.1 µF 25V 10% Ceramic Capacitor [Digikey: PCC1828TR-ND] 1.0 µF 16V 10% Ceramic Capacitor[Digikey: 490-1691-2-ND] 10.0 µF 10V 10% Ceramic Capacitor[Digikey: 709-1228-1-ND] 10.0 uF 16V 10% Ceramic Capacitor [Digikey: 478-5165-2-ND] 47 uF 6.3V 20% Ceramic Capacitor [Digikey: 587-1779-1-ND or 399-5506-1-ND] 1206 - 1206 Surface Mount Capacitors 47uF 10V 20% Ceramic Capacitor [Digikey: 490-5528-1-ND or 399-5508-1-ND or 445-6010-1-ND]
C5 C6 C24 C37 = rcl:CPOL-US: POLARIZED CAPACITOR, American symbol; SPICEPREFIX: C
CN1 = adafruit:DCBARREL: 2.0mm DC Barrel Jack DCJACK_2MM_PTH - Through Hole Jack (4UConnector: 05537)
CN2 = adafruit:USB: USB Connectors USBMINIB - Surface Mount Female Mini-B USB Connector 4UConnector: 06564 By microbuilder.eu Thru-hole RA Female Mini-B USB Connector 4UConnector: 18732 By ladyada.net
D1-D22 = microbuilder:DIODE: Diode SMADIODE - SMA Surface Mount Package 20V 1A Schottky Diode Digikey (500mV @ 1A, 500uA Vr @ 20V): 641-1014-6-ND 10V 2A Schottky Diode Digikey (350mV @ 2A, 700uA Vr @ 10V): MBRA210LT3 SOD-123 30V 200mA (800mV Vf, 2uA Vr @ 25V) Schottky Diode (very fast switching for boost, etc.) - Digikey: BAT54T1GOSTR-ND 30V 500mA (430mV Vf, 130uA Vr @ 30V) Schottky Diode - Digikey: B0530W-FDICT-ND MBR120 1A 20V (0.34Vf) Schottky Diode - Digikey: MBR120VLSFT1GOSCT-ND SOD-323 10V 570mA (380mV Vf, 3ns) Schottky Diode - Digikey: ZLLS410CT-ND 1N4148WS - 75V 150mA (1V Vf @ 10mA, 4ns) Simple Diode - Digikey: 1N4148WSFSCT-ND, Mouser: 512-1N4148WS SOD-523 BAT54 30V 200mA Schottky (0.8 Vf @ 100mA, 5ns) - Digikey: BAT54XV2CT-ND 30V 30mA Schottky Diode (RB751S-40TE61) - Digikey: RB751S-40TE61CT-ND SOT23-R/W - SOT23 Package (R = Solder Paste/Reflow Ovens, W = Hand-Soldering) BAT54Film 40V 300mA - Digikey: 497-7162-1-ND DO-1N4148 Through Hole Small Current Diode (any model)
D24-D39 = diode:BAS40: Silicon Schottky Diodes General-purpose diode for high-speed switching
F1 F2 = fuse:SHK20L: FUSE HOLDER 5 x 20 mm, SH contact, SHH1 Schukat, E1073 Buerklin; OC_FARNELL: unknown; OC_NEWARK: unknown
FB1-FB20 = microbuilder:FERRITE: Ferrite Bead 0603 MMZ1608B121C - 120 Ohm, 600mA Ferrite Chip - Digikey: 445-2164-1-ND BK1608HW121-T - 120 Ohm, 600mA Ferrite Chip - Digikey: 587-1876-2-ND
IC1 = atmel-2005:ATMEGA*: MICROCONTROLLER 64/128/256 Kbytes FLASH 4 Kbytes EEPROM 8 Kbytes SRAM 86 General Purpose I/O pins 12-channels16-bit PWM 4 x Serial USARTs 16-channels 10-bit A/D
IC2 IC4-IC12 = adafruit:MAX6675
IC3 IC13 IC15 = adafruit:78*: Positive VOLTAGE REGULATOR Added bigger pads to the TO-92 package
IC14 IC16 = burr-brown-4:INA125: Instrumentation Amplifier with Precision Voltage Reference
ICSP = SparkFun-Connectors:CONN_03X2: Multi connection point. Often used as Generic Header-pin footprint for 0.1 inch spaced/style header connections You can populate with any combo of single row headers, but if you'd like an exact match, check these: Header - 2x3 (Male, 0.1") <https://www.sparkfun.com/products/12807> (PRT-12807) Header - 2x3 (Female, 0.1") <https://www.sparkfun.com/products/13010> (PRT-13010) 2x3 Pin Shrouded Header <https://www.sparkfun.com/products/10877> (PRT-10877) On any of the 0.1 inch spaced packages, you can populate with these: Break Away Headers - Straight <https://www.sparkfun.com/products/116> (PRT-00116) Break Away Male Headers - Right Angle <https://www.sparkfun.com/products/553> (PRT-00553) Female Headers <https://www.sparkfun.com/products/115> (PRT-00115) Break Away Headers - Machine Pin <https://www.sparkfun.com/products/117> (PRT-00117) Break Away Female Headers - Swiss Machine Pin <https://www.sparkfun.com/products/743> (PRT-00743) Special note: the shrouded connector mates well with our 3x2 ribbon cables: Ribbon Crimp Connector - 6-pin (2x3, Female) <https://www.sparkfun.com/products/10651> (PRT-10651) Ribbon Cable - 6 wire (15ft) <https://www.sparkfun.com/products/10646> (PRT-10646); PROD_ID: CONN-11566
IGNITER = SparkFun-Connectors:CONN_02: Multi connection point. Often used as Generic Header-pin footprint for 0.1 inch spaced/style header connections On any of the 0.1 inch spaced packages, you can populate with these: Break Away Headers - Straight <https://www.sparkfun.com/products/116> (PRT-00116) Break Away Male Headers - Right Angle <https://www.sparkfun.com/products/553> (PRT-00553) Female Headers <https://www.sparkfun.com/products/115> (PRT-00115) Break Away Headers - Machine Pin <https://www.sparkfun.com/products/117> (PRT-00117) Break Away Female Headers - Swiss Machine Pin <https://www.sparkfun.com/products/743> (PRT-00743) For SCREWTERMINALS and SPRING TERMINALS visit here: Screw Terimnals on SparkFun.com <https://www.sparkfun.com/search/results?term=Screw+Terminals> (5mm/3.5mm/2.54mm spacing) This device is also useful as a general connection point to wire up your design to another part of your project. Our various solder wires solder well into these plated through hole pads. Hook-Up Wire - Assortment (Stranded, 22 AWG) <https://www.sparkfun.com/products/11375> (PRT-11375) Hook-Up Wire - Assortment (Solid Core, 22 AWG) <https://www.sparkfun.com/products/11367> (PRT-11367) View the entire wire category on our website here <https://www.sparkfun.com/categories/141> Special notes: Molex polarized connector foot print use with: PRT-08233 with associated crimp pins and housings. 2.54_SCREWTERM for use with PRT-10571. 3.5mm Screw Terminal footprints for PRT-08084 5mm Screw Terminal footprints for use with PRT-08432; SF_SKU: PRT-08432
J1-J6 = SparkFun-Connectors:RJ45-8: RJ45 Jack - 8 pin Simple RJ45, 8-pin connection. Commonly used for Cat5, Cat5e, and Cat6 Ethernet cables. Here is the connector we sell at SparkFun: RJ45 8-Pin Connector <https://www.sparkfun.com/products/643> (PRT-00643) Datasheet <https://cdn.sparkfun.com/datasheets/Prototyping/04908.pdf> It is used on this SparkFun product: SparkFun RJ45 Breakout <https://www.sparkfun.com/products/716> (BOB-00716) Note, you may also be interested in the "MAGJACK" version of this. It is basically a RJ45 connector, but also has some status LEDs built into the connector housing. You can check that out in this library at the device named "MAGJACK.dev" and see these products online: RJ45 Ethernet MagJack-Compatible <https://www.sparkfun.com/products/8534> (PRT-08534) SparkFun RJ45 MagJack Breakout <https://www.sparkfun.com/products/13021> (BOB-13021); PROD_ID: CONN-08506; SF_ID: PRT-00643
LED1-LED4 = microbuilder:LED: LED 0603 - 0603 Surface Mount Package 2mA: Green LED - Low Power (3.9mcd, 2ma, 1.7Vf) - Digikey: 475-2709-2-ND Orange LED - Low Power (9.8mcd, 2ma, 1.8Vf) - Digikey: 475-1194-2-ND Red LED - Low Power (5mcd, 2ma, 1.8Vf) - Digikey: 475-1195-2-ND Yellow LED - Low Power (7mcd, 2ma, 1.8Vf) - Digikey: 475-1196-2-ND 5mA: Blue LED - Low Power (17mcd, 5ma, 2.9Vf) - Digikey: LNJ937W8CRACT-ND 0805 - 0805 Surface Mount Package 2mA: Red LED (8.8mcd, 2mA, 1.8Vf, Clear) - Low Power [Digikey: 475-2510-1-ND] Green LED (5mcd, 2mA, 1.8Vf, Clear) - Low Power [Digikey: 475-2730-1-ND] Yellow LED (11.3mcd, 2mA, 1.8Vf, Clear) - Low Power [Digikey: 475-2555-1-ND] 20mA: Red LED (104mcd, 20mA, Diffused) - LS R976 [Digikey: 475-1278-6-ND] Red LED (12mcd, 20mA, 2.0Vf, Clear) - APT2012EC [Digikey: 754-1128-1-ND] Green LED (15mcd, 20mA, 2.2Vf, Clear) - APT2012GC [Digikey: 754-1131-1-ND] Orange LED (160mcd, 20mA, 2.1Vf, Clear) - APT2012SECK [Digikey: 754-1130-1-ND] 1206 - 1206 Surface Mount Package Green LED (26mcd, 20mA, Diffused) - LG N971 [Digikey: 475-1407-6-ND] Red LED (15mcd, 20mA, Diffused) - LH N974 [Digikey: 475-1416-6-ND]
LOADCELL1 LOADCELL2 = SparkFun-Connectors:CONN_04: Multi connection point. Often used as Generic Header-pin footprint for 0.1 inch spaced/style header connections On any of the 0.1 inch spaced packages, you can populate with these: Break Away Headers - Straight <https://www.sparkfun.com/products/116> (PRT-00116) Break Away Male Headers - Right Angle <https://www.sparkfun.com/products/553> (PRT-00553) Female Headers <https://www.sparkfun.com/products/115> (PRT-00115) Break Away Headers - Machine Pin <https://www.sparkfun.com/products/117> (PRT-00117) Break Away Female Headers - Swiss Machine Pin <https://www.sparkfun.com/products/743> (PRT-00743) For SCREWTERMINALS and SPRING TERMINALS visit here: Screw Terimnals on SparkFun.com <https://www.sparkfun.com/search/results?term=Screw+Terminals> (5mm/3.5mm/2.54mm spacing) This device is also useful as a general connection point to wire up your design to another part of your project. Our various solder wires solder well into these plated through hole pads. Hook-Up Wire - Assortment (Stranded, 22 AWG) <https://www.sparkfun.com/products/11375> (PRT-11375) Hook-Up Wire - Assortment (Solid Core, 22 AWG) <https://www.sparkfun.com/products/11367> (PRT-11367) View the entire wire category on our website here <https://www.sparkfun.com/categories/141> Special notes: Molex polarized connector foot print use with SKU : PRT-08231 with associated crimp pins and housings. 1MM SMD Version SKU: PRT-10208; PROD_ID: CONN-09696
PT1-PT10 = SparkFun-Connectors:CONN_03: Multi connection point. Often used as Generic Header-pin footprint for 0.1 inch spaced/style header connections On any of the 0.1 inch spaced packages, you can populate with these: Break Away Headers - Straight <https://www.sparkfun.com/products/116> (PRT-00116) Break Away Male Headers - Right Angle <https://www.sparkfun.com/products/553> (PRT-00553) Female Headers <https://www.sparkfun.com/products/115> (PRT-00115) Break Away Headers - Machine Pin <https://www.sparkfun.com/products/117> (PRT-00117) Break Away Female Headers - Swiss Machine Pin <https://www.sparkfun.com/products/743> (PRT-00743) Stackable Header - 3 Pin (Female, 0.1") <https://www.sparkfun.com/products/13875> (PRT-13875) For SCREWTERMINALS and SPRING TERMINALS visit here: Screw Terimnals on SparkFun.com <https://www.sparkfun.com/search/results?term=Screw+Terminals> (5mm/3.5mm/2.54mm spacing) This device is also useful as a general connection point to wire up your design to another part of your project. Our various solder wires solder well into these plated through hole pads. Hook-Up Wire - Assortment (Stranded, 22 AWG) <https://www.sparkfun.com/products/11375> (PRT-11375) Hook-Up Wire - Assortment (Solid Core, 22 AWG) <https://www.sparkfun.com/products/11367> (PRT-11367) View the entire wire category on our website here <https://www.sparkfun.com/categories/141> Special notes: Molex polarized connector foot print use with SKU : PRT-08232 with associated crimp pins and housings.
Q1 Q2 = User-Submitted:TRANSISTOR_PNP: Generic PNP BJT Double check pinouts against datasheets- not all devices are the same! MMBT3906 - 40V 200mA SOT-23 (TRANS-08052) MMBT4403 - 40V 600mA SOT-23 (TRANS-09245)
R1-R69 R75-R79 = microbuilder:RESISTOR: Resistors 0402 - 0402 Surface Mount Package 22 Ohm 1% 1/16W [Digikey: 311-22.0LRTR-ND] 33 Ohm 5% 1/16W 1.0K 5% 1/16W 1.5K 5% 1/16W 2.0K 1% 1/16W 10.0K 1% 1/16W [Digikey: 311-10.0KLRTR-ND] 10.0K 5% 1/16W [Digikey: RMCF0402JT10K0TR-ND] 12.1K 1% 1/16W [Digikey: 311-22.0LRTR-ND] 100.0K 5% 1/16W 0603 - 0603 Surface Mount Package 0 Ohm 1/10 Watt 1% Resistor 15 Ohm 1/10 Watt 1% Resistor 33 Ohm 1/10 Watt 1% Resistor 49.9 Ohm 1/10 Watt 1% Resistor 100 Ohm 1/10 Watt 1% Resistor 150 Ohm 1/10 Watt 1% Resistor 240 Ohm 1/10 Watt 1% Resistor 390 Ohm 1/10 Watt 1% Resistor 560 Ohm 1/10 Watt 1% Resistor 680 Ohm 1/10 Watt 1% Resistor 750 Ohm 1/10 Watt 1% Resistor 1.0K Ohm 1/10 Watt 1% Resistor 1.5K Ohm 1/10 Watt 1% Resistor 2.0K Ohm 1/10 Watt 1% Resistor 2.2K Ohm 1/10 Watt 1% Resistor 3.3K Ohm 1/10 Watt 1% Resistor 4.7K Ohm 1/10 Watt 1% Resistor 10.0K Ohm 1/10 Watt 1% Resistor 12.0K Ohm 1/10 Watt 1% Resistor 12.1K Ohm 1/10 Watt 1% Resistor 20.0K Ohm 1/10 Watt 1% Resistor 33.0K Ohm 1/10 Watt 1% Resistor 100.0K Ohm 1/10 Watt 1% Resistor 0805 - 0805 Surface Mount Package 0 Ohm 1/8 Watt 1% Resistor 33 Ohm 1/8 Watt 1% Resistor 100 Ohm 1/8 Watt 1% Resistor 150 Ohm 1/8 Watt 1% Resistor 200 Ohm 1/8 Watt 1% Resistor 240 Ohm 1/8 Watt 1% Resistor 330 Ohm 1/8 Watt 1% Resistor 390 Ohm 1/8 Watt 1% Resistor 470 Ohm 1/8 Watt 1% Resistor 1.0K Ohm 1/8 Watt 1% Resistor 1.5K Ohm 1/8 Watt 1% Resistor 2.0K Ohm 1/8 Watt 1% Resistor 4.7K Ohm 1/8 Watt 1% Resistor 5.1K Ohm 1/8 Watt 1% Resistor 5.6K Ohm 1/8 Watt 1% Resistor 10.0K Ohm 1/8 Watt 1% Resistor 22.0K Ohm 1/8 Watt 1% Resistor 33.0K Ohm 1/8 Watt 1% Resistor 100K Ohm 1/8 Watt 1% Resistor 1206 - 1206 Surface Mount Package 2012 - 2010 Surface Mount Package 0.11 Ohm 1/2 Watt 1% Resistor - Digikey: RHM.11UCT-ND
R70-R74 R80 R81 = adafruit:R-US_: RESISTOR, American symbol
S1 = switch-tact:DTSM-6
SCALE1 SCALE2 = SparkFun-Connectors:CONN_06: Multi connection point. Often used as Generic Header-pin footprint for 0.1 inch spaced/style header connections On any of the 0.1 inch spaced packages, you can populate with these: Break Away Headers - Straight <https://www.sparkfun.com/products/116> (PRT-00116) Break Away Male Headers - Right Angle <https://www.sparkfun.com/products/553> (PRT-00553) Female Headers <https://www.sparkfun.com/products/115> (PRT-00115) Break Away Headers - Machine Pin <https://www.sparkfun.com/products/117> (PRT-00117) Break Away Female Headers - Swiss Machine Pin <https://www.sparkfun.com/products/743> (PRT-00743) Arduino Stackable Header - 6 Pin <https://www.sparkfun.com/products/9280> (PRT-09280) For SCREWTERMINALS and SPRING TERMINALS visit here: Screw Terimnals on SparkFun.com <https://www.sparkfun.com/search/results?term=Screw+Terminals> (5mm/3.5mm/2.54mm spacing) This device is also useful as a general connection point to wire up your design to another part of your project. Our various solder wires solder well into these plated through hole pads. Hook-Up Wire - Assortment (Stranded, 22 AWG) <https://www.sparkfun.com/products/11375> (PRT-11375) Hook-Up Wire - Assortment (Solid Core, 22 AWG) <https://www.sparkfun.com/products/11367> (PRT-11367) View the entire wire category on our website here <https://www.sparkfun.com/categories/141>; PROD_ID: CONN-08437
SOL1_WSV_2 SOL2_NV_2 SOL3_OV_4 SOL4_OV_5 SOL5 = con-hdrs40:HDR-1X2: HEADER CONNECTOR
U1 = microbuilder:FT232RL: FTDI FT232RL USB TO RS232 Converter Digikey: 768-1007-1-ND
U2-U4 = microbuilder:ADC_ADS1015: ADS1015 - 12-bit 4-Channel I2C ADC with Internal PGA VDD: 2.0-5.5V Sampling Rate: 3.3ksps Gain Settings: 2/3, 1, 2, 4, 8, 16 I2C Address: ADDR low = 1001000x, ADDR high = 1001001x Internal Comparator The ADS1015 includes an internal comparator that can be set to output a high-level on ALERT when the conversion results exceeeds a pre-defined upper level, and will deassert itself when the level falls below a pre-defined lower threshold level. It can also be set to windowed mode where the ALERT pin will be asserted if the data exceeds the upper threshold or falls below the lower threshold.
U5 U6 = SparkFun-IC-Conversion:HX711: AVIA Semiconductor HX711 - ADC 24-Bit Analog-to-Digital Converter for Weigh Scales Datasheet <https://cdn.sparkfun.com/datasheets/Sensors/ForceFlex/hx711_english.pdf> SparkFun Products: SparkFun Load Cell Amplifier - HX711 <https://www.sparkfun.com/products/13879>; PROD_ID: IC-12445
U$1 = SparkFun:RESONATOR: Resonator Small SMD resonator. This is the itty bitty 10/20MHz resonators with built in caps. CSTCE10M0G55 and CSTCE20M0V53. Footprint has been reviewed closely but hasn't been tested yet.
U$128-U$132 U$138 = goodsky1:RW-SH

## Net classes
0 default: width 0.203 mm, drill 0.254 mm, clearance 0.127 mm
1 16mil: width 0.254 mm, drill 0.254 mm, clearance 0.127 mm
2 24mil: width 0.254 mm, drill 0.254 mm, clearance 0.127 mm
3 32mil: width 0.254 mm, drill 0.254 mm, clearance 0.127 mm